# Altium schematic sheet salinity.SchDoc
size A
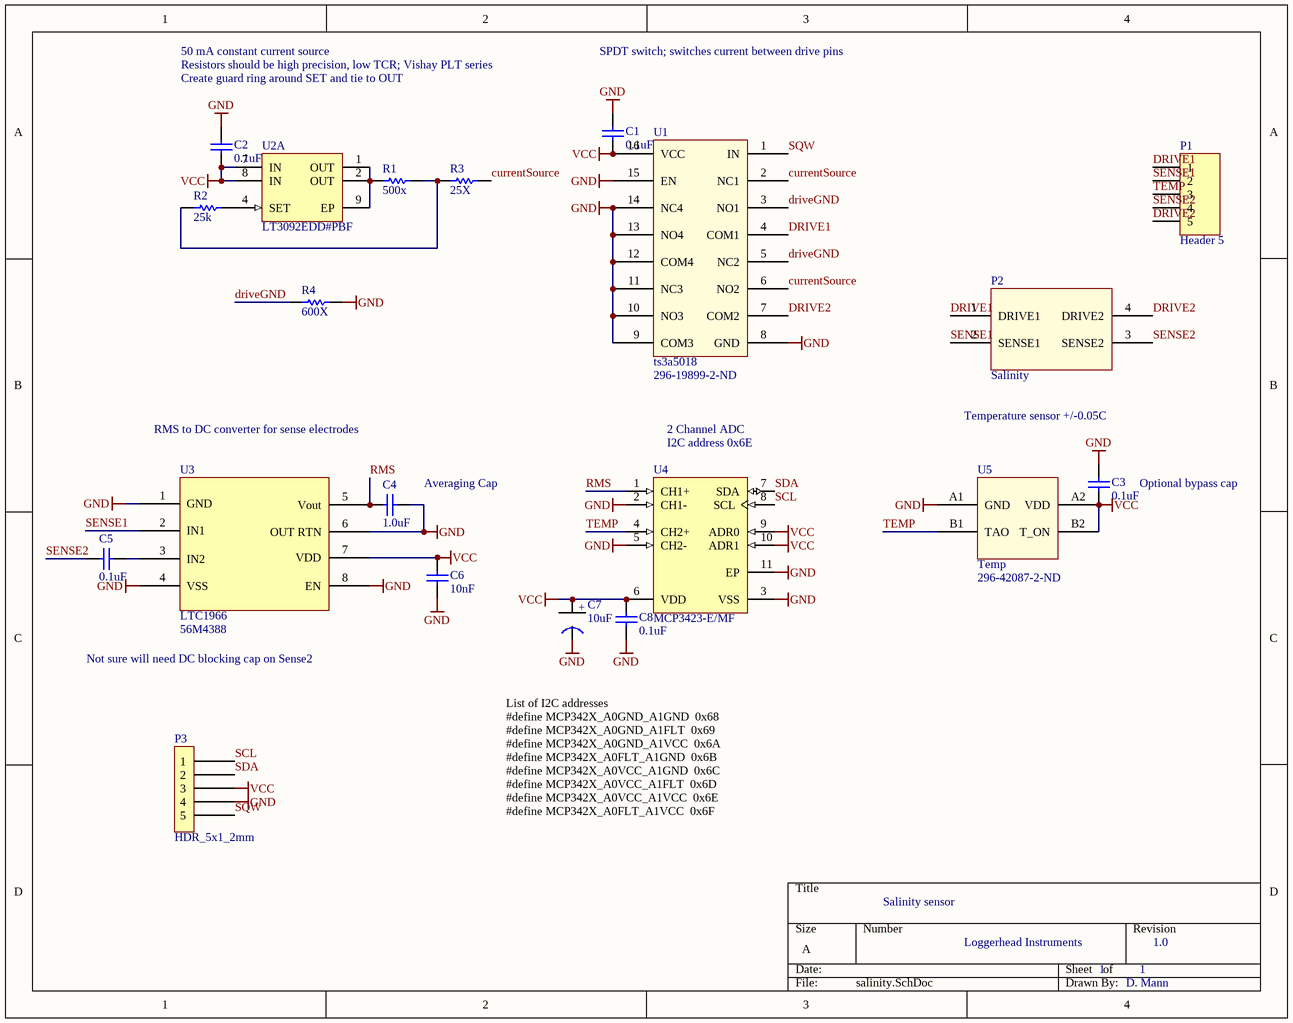
[diagram p0: salinity.SchDoc]

## Parts
C1  0.1uF  [0402]
C2  0.1uF  [0402]
C3  0.1uF  [0402]
C4  1.0uF  [0402]
C5  0.1uF  [0402]
C6  10nF  [0402]
C7  10uF  [Tant0805]
C8  0.1uF  [0402]
P1  Header 5  [HDR1X5]
P2  Salinity  [SALINITY]
P3  HDR_5x1_2mm  [Hdr_5x1_2mm]
R1  500x  [3-0603]
R2  25k  [3-0603]
R3  25X  [3-0603]
R4  600X  [3-0603]
U1  ts3a5018  Supplier Part Number 1: 296-19899-2-ND  [ts3a5018_VQFN]
U2  LT3092EDD#PBF  [LT-DD-8_V]  (part A of 2)
U3  LTC1966  Supplier Part Number 1: 56M4388  [MSOP8-LTC1966]
U4  MCP3423-E/MF  [DFN-MF10]
U5  Temp  Supplier Part Number 1: 296-42087-2-ND  [BGA4_TMP103]

## Nets
GND: C1.1 C2.1 C3.1 C4.2 C6.1 C7.1(GND) C8.1 P3.4 R4.2 U1.8(GND) U1.9(COM3) U1.10(NO3) U1.11(NC3) U1.12(COM4) U1.13(NO4) U1.14(NC4) U1.15(EN) U3.1(GND) U3.4(VSS) U3.6(OUT_RTN) U3.8(EN) U4.2(CH1-) U4.3(VSS) U4.5(CH2-) U4.11(EP) U5.A1(GND)
VCC: C1.2 C2.2 C3.2 C6.2 C7.2(+) C8.2 P3.3 U1.16(VCC) U2.7(IN) U2.8(IN) U3.7(VDD) U4.6(VDD) U4.9(ADR0) U4.10(ADR1) U5.A2(VDD) U5.B2(T_ON)
currentSource: R3.2 U1.2(NC1) U1.6(NO2)
DRIVE1: P1.1 P2.1(DRIVE1) U1.4(COM1)
DRIVE2: P1.5 P2.4(DRIVE2) U1.7(COM2)
driveGND: R4.1 U1.3(NO1) U1.5(NC2)
RMS: C4.1 U3.5(Vout) U4.1(CH1+)
SCL: P3.1 U4.8(SCL)
SDA: P3.2 U4.7(SDA)
SENSE1: P1.2 P2.2(SENSE1) U3.2(IN1)
SENSE2: C5.1 P1.4 P2.3(SENSE2)
SQW: P3.5 U1.1(IN)
TEMP: P1.3 U4.4(CH2+) U5.B1(TAO)
NetC5_2: C5.2 U3.3(IN2)
NetR1_1: R1.1 U2.1(OUT) U2.2(OUT) U2.9(EP)
NetR1_2: R1.2 R2.1 R3.1
NetR2_2: R2.2 U2.4(SET)

## Notes on the sheet
- Create guard ring around SET and tie to OUT
- 50 mA constant current source
- Resistors should be high precision, low TCR; Vishay PLT series
- SPDT switch; switches current between drive pins
- RMS to DC converter for sense electrodes
- 2 Channel ADC
- Temperature sensor +/-0.05C
- (near C4) Averaging Cap
- (near U4) I2C address 0x6E
- (near C3) Optional bypass cap
- Not sure will need DC blocking cap on Sense2
- List of I2C addresses
  #define MCP342X_A0GND_A1GND		0x68
  #define MCP342X_A0GND_A1FLT		0x69
  #define MCP342X_A0GND_A1VCC		0x6A
  #define MCP342X_A0FLT_A1GND		0x6B
  #define MCP342X_A0VCC_A1GND		0x6C
  #define MCP342X_A0VCC_A1FLT		0x6D
  #define MCP342X_A0VCC_A1VCC		0x6E
  #define MCP342X_A0FLT_A1VCC		0x6F
- Salinity sensor
- Loggerhead Instruments
- 1
- 1.0
- D. Mann

## Library data of the parts
C1-C3 C5 C8 = C0402: Ceramic Chip Capacitor - Standard; Note: Footprint corresponds to dimensions for bulk cassette packaging. This case size has tightened tolerances.; Published: 17-Jul-2002; LatestRevisionDate: 19-Mar-2004; LatestRevisionNote: Silkscreen size reduced.; DatasheetDocument: Mar-2001; PackageDocument: Mar-2001; PackageReference: 0402; Publisher: Altium Limited; Code_JEITA: 0402; Code_IPC: 1005 [0402]; ComponentLink1Description: Manufacturer Link; ComponentLink1URL: http://www.kemet.com/; ComponentLink2Description: Datasheet; ComponentLink2URL: http://www.kemet.com/kemet/web/homepage/kechome.nsf/vapubfilesname/F3102TA.pdf/$file/F3102TA.pdf; Value: 0.1uF
C4 C6 = C0402: Ceramic Chip Capacitor - Standard; Note: Footprint corresponds to dimensions for bulk cassette packaging. This case size has tightened tolerances.; Value: 0.1uF; Published: 17-Jul-2002; LatestRevisionDate: 19-Mar-2004; LatestRevisionNote: Silkscreen size reduced.; DatasheetDocument: Mar-2001; PackageDocument: Mar-2001; PackageReference: 0402; Publisher: Altium Limited; Code_JEITA: 0402; Code_IPC: 1005 [0402]; ComponentLink1Description: Manufacturer Link; ComponentLink1URL: http://www.kemet.com/; ComponentLink2Description: Datasheet; ComponentLink2URL: http://www.kemet.com/kemet/web/homepage/kechome.nsf/vapubfilesname/F3102TA.pdf/$file/F3102TA.pdf
C7 = Tant0805: Value: 10uF
P1 = Header 5: Header, 5-Pin; LatestRevisionDate: 17-Jul-2002; LatestRevisionNote: Re-released for DXP Platform.; Publisher: Altium Limited
R1-R4 = ERJ3BQ: Low Ohmic Value Thick Film Chip Resistor, 0.22 Ohm to 9.1 Ohm Range, 1%, 2% and 5% Tolerance, 0603 Size, 0.2 W; Published: 17-Dec-2003; LatestRevisionDate: 19-Mar-2004; LatestRevisionNote: Silkscreen size reduced.; PackageDocument: Mar-2003; PackageReference: 3-0603; Publisher: Altium Limited; Code_IPC: 1608 [0603]; ComponentLink1Description: Manufacturer Link; ComponentLink1URL: http://www.panasonic.com/industrial/components/resistive_products.htm; ComponentLink2Description: Datasheet; ComponentLink2URL: http://www.panasonic.com/industrial/components/pdf/AOA0000CE3.pdf
U1 = ts3a5018: Quad SPDT; Supplier 1: Digi-Key
U2 = LT3092EDD#PBF: 200 mA Two-Terminal Programmable Current Source, 0.3 mA Isupply, 8-pin SON (DD-8), -40 to 125 degC, Pb-Free; Manufacturer: Linear Technology; Extended Temp: E, I, MP; Initial Accuracy(%): 1; Isupply(mA): 0.3; Output Current Range: 0.5 mA to 200 mA; Vin Max(V): 40; Vin Min(V): 1.2; DatasheetVersion: Rev. B; PackageVersion: Jun-10; PackageReference: DD-8; PackageDescription: 8-Pin Plastic DFN, Body 3 x 3 mm, Pitch 0.5 mm; Supplier 1: Digi-Key; Supplier Part Number 1: LT3092EDD#PBF-ND; Supplier 2: Farnell; Supplier Part Number 2: 2295468; Supplier 3: Newark; Supplier Part Number 3: 72R5810; RoHS: TRUE; Mounting Technology: Surface Mount; Code_JEDEC: MO-229; PartNumber: LT3092EDD#PBF; ComponentLink1Description: Manufacturer URL; ComponentLink1URL: http://www.linear.com/; ComponentLink2Description: Datasheet; ComponentLink2URL: http://cds.linear.com/docs/en/datasheet/3092fb.pdf; ComponentLink3Description: Package Specification; ComponentLink3URL: http://cds.linear.com/docs/en/packaging/DFN_8_05-08-1698.pdf
U4 = MCP3423-E/MF: 18-Bit, 4-Channel Analog-to-Digital Converter with I2C Interface and On-Board Reference, 10-pin DFN, Extended Temperature; Manufacturer: Microchip; DatasheetVersion: revC, Aug-2009; PackageVersion: revBB, Aug-2009; PackageReference: DFN-MF10; PackageDescription: 10-Lead Plastic Dual Flat, No Lead Package (MF) - 3x3x0.9mm Body [DFN]; Supplier 1: Digi-Key; Supplier Part Number 1: MCP3423-E/MF-ND; Supplier 2: Farnell; Supplier Part Number 2: 1834908; Supplier 3: Newark; Supplier Part Number 3: 54M4867; Supplier 4: Mouser; Supplier Part Number 4: 579-MCP3423-E/MF; Mounting Technology: Surface Mount; PartNumber: MCP3423-E/MF; ComponentLink1Description: Manufacturer URL; ComponentLink1URL: http://www.microchip.com/; ComponentLink2Description: Datasheet; ComponentLink2URL: http://ww1.microchip.com/downloads/en/DeviceDoc/22088c.pdf; ComponentLink3Description: Package Specification; ComponentLink3URL: http://www.microchip.com/stellent/groups/techpub_sg/documents/packagingspec/en012702.pdf
U5 = LMT70: Supplier 1: Digi-Key
U3 = LTC1966: Supplier 1: Newark